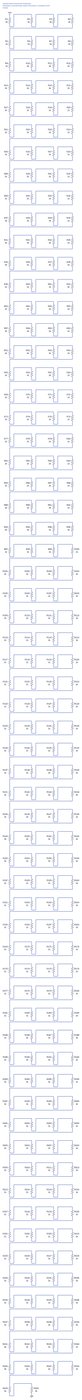
[diagram p0: schematic circuit.asc, whole sheet]
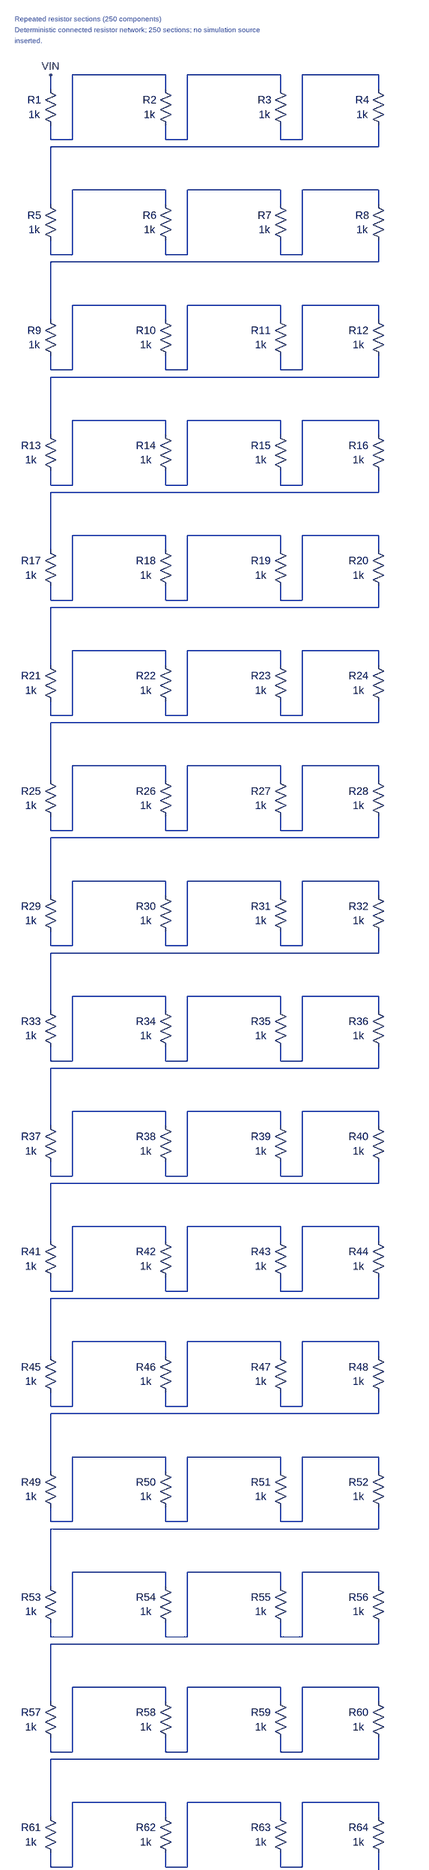
[diagram p1: schematic circuit.asc, part, row 1 of 4, column 1 of 1]
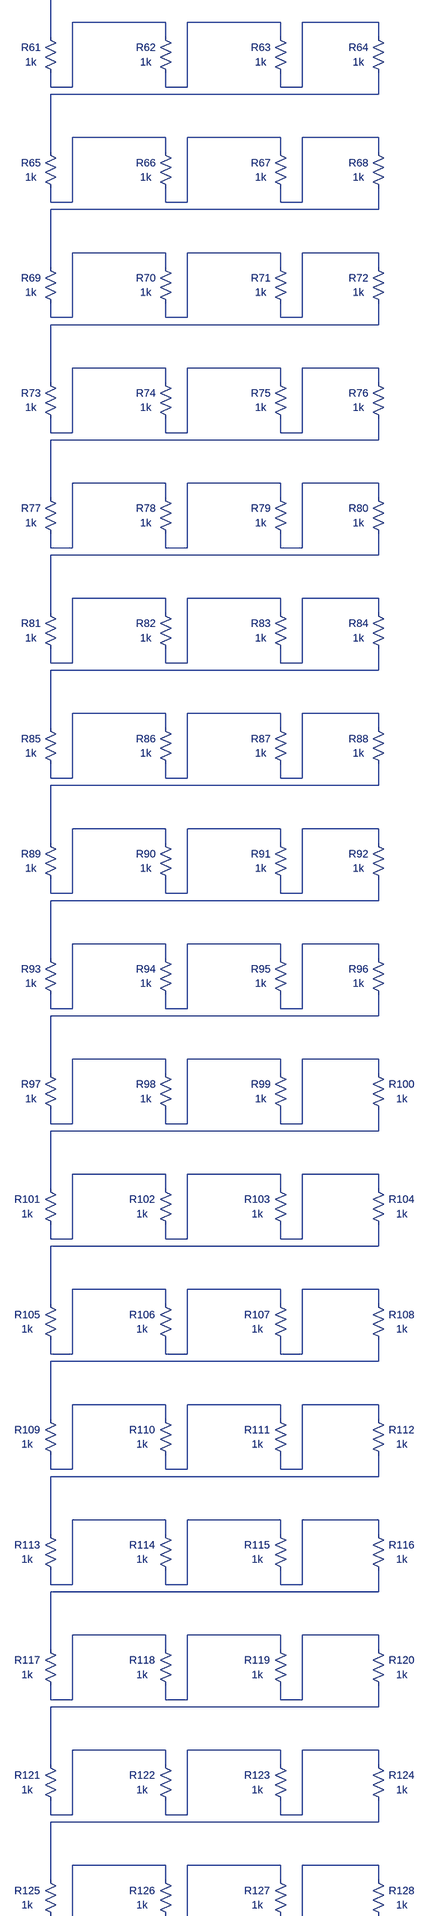
[diagram p2: schematic circuit.asc, part, row 2 of 4, column 1 of 1]
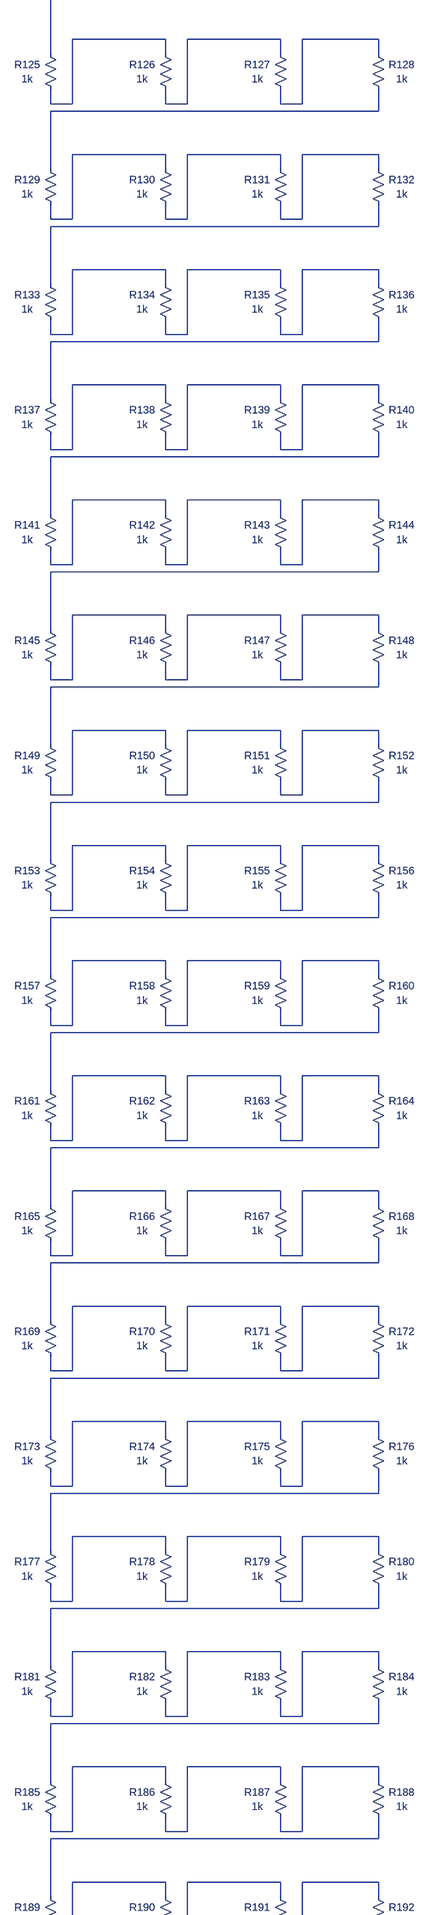
[diagram p3: schematic circuit.asc, part, row 3 of 4, column 1 of 1]
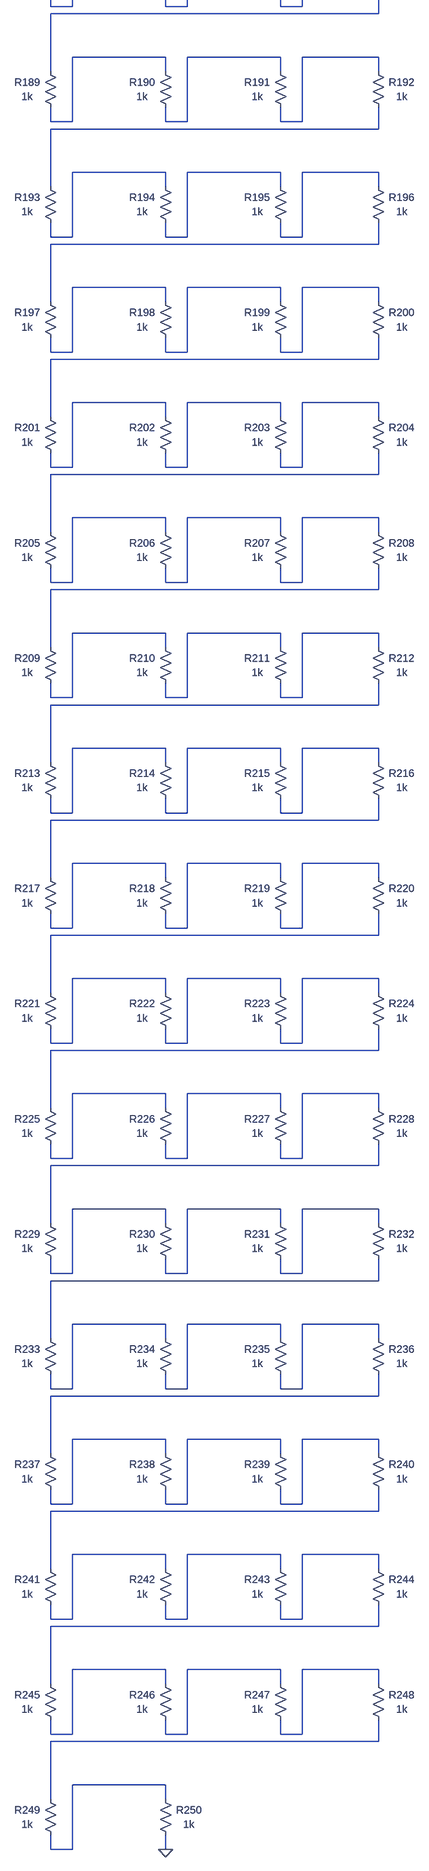
[diagram p4: schematic circuit.asc, part, row 4 of 4, column 1 of 1]
* circuit.asc
R1 VIN N001 1k
R2 N001 N126 1k
R3 N126 N188 1k
R4 N188 N002 1k
R5 N002 N003 1k
R6 N003 N127 1k
R7 N127 N189 1k
R8 N189 N004 1k
R9 N004 N005 1k
R10 N005 N128 1k
R11 N128 N190 1k
R12 N190 N006 1k
R13 N006 N007 1k
R14 N007 N129 1k
R15 N129 N191 1k
R16 N191 N008 1k
R17 N008 N009 1k
R18 N009 N130 1k
R19 N130 N192 1k
R20 N192 N010 1k
R21 N010 N011 1k
R22 N011 N131 1k
R23 N131 N193 1k
R24 N193 N012 1k
R25 N012 N013 1k
R26 N013 N132 1k
R27 N132 N194 1k
R28 N194 N014 1k
R29 N014 N015 1k
R30 N015 N133 1k
R31 N133 N195 1k
R32 N195 N016 1k
R33 N016 N017 1k
R34 N017 N134 1k
R35 N134 N196 1k
R36 N196 N018 1k
R37 N018 N019 1k
R38 N019 N135 1k
R39 N135 N197 1k
R40 N197 N020 1k
R41 N020 N021 1k
R42 N021 N136 1k
R43 N136 N198 1k
R44 N198 N022 1k
R45 N022 N023 1k
R46 N023 N137 1k
R47 N137 N199 1k
R48 N199 N024 1k
R49 N024 N025 1k
R50 N025 N138 1k
R51 N138 N200 1k
R52 N200 N026 1k
R53 N026 N027 1k
R54 N027 N139 1k
R55 N139 N201 1k
R56 N201 N028 1k
R57 N028 N029 1k
R58 N029 N140 1k
R59 N140 N202 1k
R60 N202 N030 1k
R61 N030 N031 1k
R62 N031 N141 1k
R63 N141 N203 1k
R64 N203 N032 1k
R65 N032 N033 1k
R66 N033 N142 1k
R67 N142 N204 1k
R68 N204 N034 1k
R69 N034 N035 1k
R70 N035 N143 1k
R71 N143 N205 1k
R72 N205 N036 1k
R73 N036 N037 1k
R74 N037 N144 1k
R75 N144 N206 1k
R76 N206 N038 1k
R77 N038 N039 1k
R78 N039 N145 1k
R79 N145 N207 1k
R80 N207 N040 1k
R81 N040 N041 1k
R82 N041 N146 1k
R83 N146 N208 1k
R84 N208 N042 1k
R85 N042 N043 1k
R86 N043 N147 1k
R87 N147 N209 1k
R88 N209 N044 1k
R89 N044 N045 1k
R90 N045 N148 1k
R91 N148 N210 1k
R92 N210 N046 1k
R93 N046 N047 1k
R94 N047 N149 1k
R95 N149 N211 1k
R96 N211 N048 1k
R97 N048 N049 1k
R98 N049 N150 1k
R99 N150 N212 1k
R100 N212 N050 1k
R101 N050 N051 1k
R102 N051 N151 1k
R103 N151 N213 1k
R104 N213 N052 1k
R105 N052 N053 1k
R106 N053 N152 1k
R107 N152 N214 1k
R108 N214 N054 1k
R109 N054 N055 1k
R110 N055 N153 1k
R111 N153 N215 1k
R112 N215 N056 1k
R113 N056 N057 1k
R114 N057 N154 1k
R115 N154 N216 1k
R116 N216 N058 1k
R117 N058 N059 1k
R118 N059 N155 1k
R119 N155 N217 1k
R120 N217 N060 1k
R121 N060 N061 1k
R122 N061 N156 1k
R123 N156 N218 1k
R124 N218 N062 1k
R125 N062 N063 1k
R126 N063 N157 1k
R127 N157 N219 1k
R128 N219 N064 1k
R129 N064 N065 1k
R130 N065 N158 1k
R131 N158 N220 1k
R132 N220 N066 1k
R133 N066 N067 1k
R134 N067 N159 1k
R135 N159 N221 1k
R136 N221 N068 1k
R137 N068 N069 1k
R138 N069 N160 1k
R139 N160 N222 1k
R140 N222 N070 1k
R141 N070 N071 1k
R142 N071 N161 1k
R143 N161 N223 1k
R144 N223 N072 1k
R145 N072 N073 1k
R146 N073 N162 1k
R147 N162 N224 1k
R148 N224 N074 1k
R149 N074 N075 1k
R150 N075 N163 1k
R151 N163 N225 1k
R152 N225 N076 1k
R153 N076 N077 1k
R154 N077 N164 1k
R155 N164 N226 1k
R156 N226 N078 1k
R157 N078 N079 1k
R158 N079 N165 1k
R159 N165 N227 1k
R160 N227 N080 1k
R161 N080 N081 1k
R162 N081 N166 1k
R163 N166 N228 1k
R164 N228 N082 1k
R165 N082 N083 1k
R166 N083 N167 1k
R167 N167 N229 1k
R168 N229 N084 1k
R169 N084 N085 1k
R170 N085 N168 1k
R171 N168 N230 1k
R172 N230 N086 1k
R173 N086 N087 1k
R174 N087 N169 1k
R175 N169 N231 1k
R176 N231 N088 1k
R177 N088 N089 1k
R178 N089 N170 1k
R179 N170 N232 1k
R180 N232 N090 1k
R181 N090 N091 1k
R182 N091 N171 1k
R183 N171 N233 1k
R184 N233 N092 1k
R185 N092 N093 1k
R186 N093 N172 1k
R187 N172 N234 1k
R188 N234 N094 1k
R189 N094 N095 1k
R190 N095 N173 1k
R191 N173 N235 1k
R192 N235 N096 1k
R193 N096 N097 1k
R194 N097 N174 1k
R195 N174 N236 1k
R196 N236 N098 1k
R197 N098 N099 1k
R198 N099 N175 1k
R199 N175 N237 1k
R200 N237 N100 1k
R201 N100 N101 1k
R202 N101 N176 1k
R203 N176 N238 1k
R204 N238 N102 1k
R205 N102 N103 1k
R206 N103 N177 1k
R207 N177 N239 1k
R208 N239 N104 1k
R209 N104 N105 1k
R210 N105 N178 1k
R211 N178 N240 1k
R212 N240 N106 1k
R213 N106 N107 1k
R214 N107 N179 1k
R215 N179 N241 1k
R216 N241 N108 1k
R217 N108 N109 1k
R218 N109 N180 1k
R219 N180 N242 1k
R220 N242 N110 1k
R221 N110 N111 1k
R222 N111 N181 1k
R223 N181 N243 1k
R224 N243 N112 1k
R225 N112 N113 1k
R226 N113 N182 1k
R227 N182 N244 1k
R228 N244 N114 1k
R229 N114 N115 1k
R230 N115 N183 1k
R231 N183 N245 1k
R232 N245 N116 1k
R233 N116 N117 1k
R234 N117 N184 1k
R235 N184 N246 1k
R236 N246 N118 1k
R237 N118 N119 1k
R238 N119 N185 1k
R239 N185 N247 1k
R240 N247 N120 1k
R241 N120 N121 1k
R242 N121 N186 1k
R243 N186 N248 1k
R244 N248 N122 1k
R245 N122 N123 1k
R246 N123 N187 1k
R247 N187 N249 1k
R248 N249 N124 1k
R249 N124 N125 1k
R250 N125 0 1k
* Repeated resistor sections (250 components)
* Deterministic connected resistor network; 250 sections; no simulation source
* inserted.
.backanno
.end